# Altium schematic sheet adc.SchDoc: ADC and current shunts
size A3; Author: Daniele Basile <asterix@develer.com>; Organization: Develer s.r.l.; Address1: via Mugellese 1/A; Address2: 50019 Campi Bisenzio; Address3: Firenze; Address4: ITALY; DocumentNumber: 4; Revision: A; SheetNumber: 4; SheetTotal: 4; Hw_rev: R1
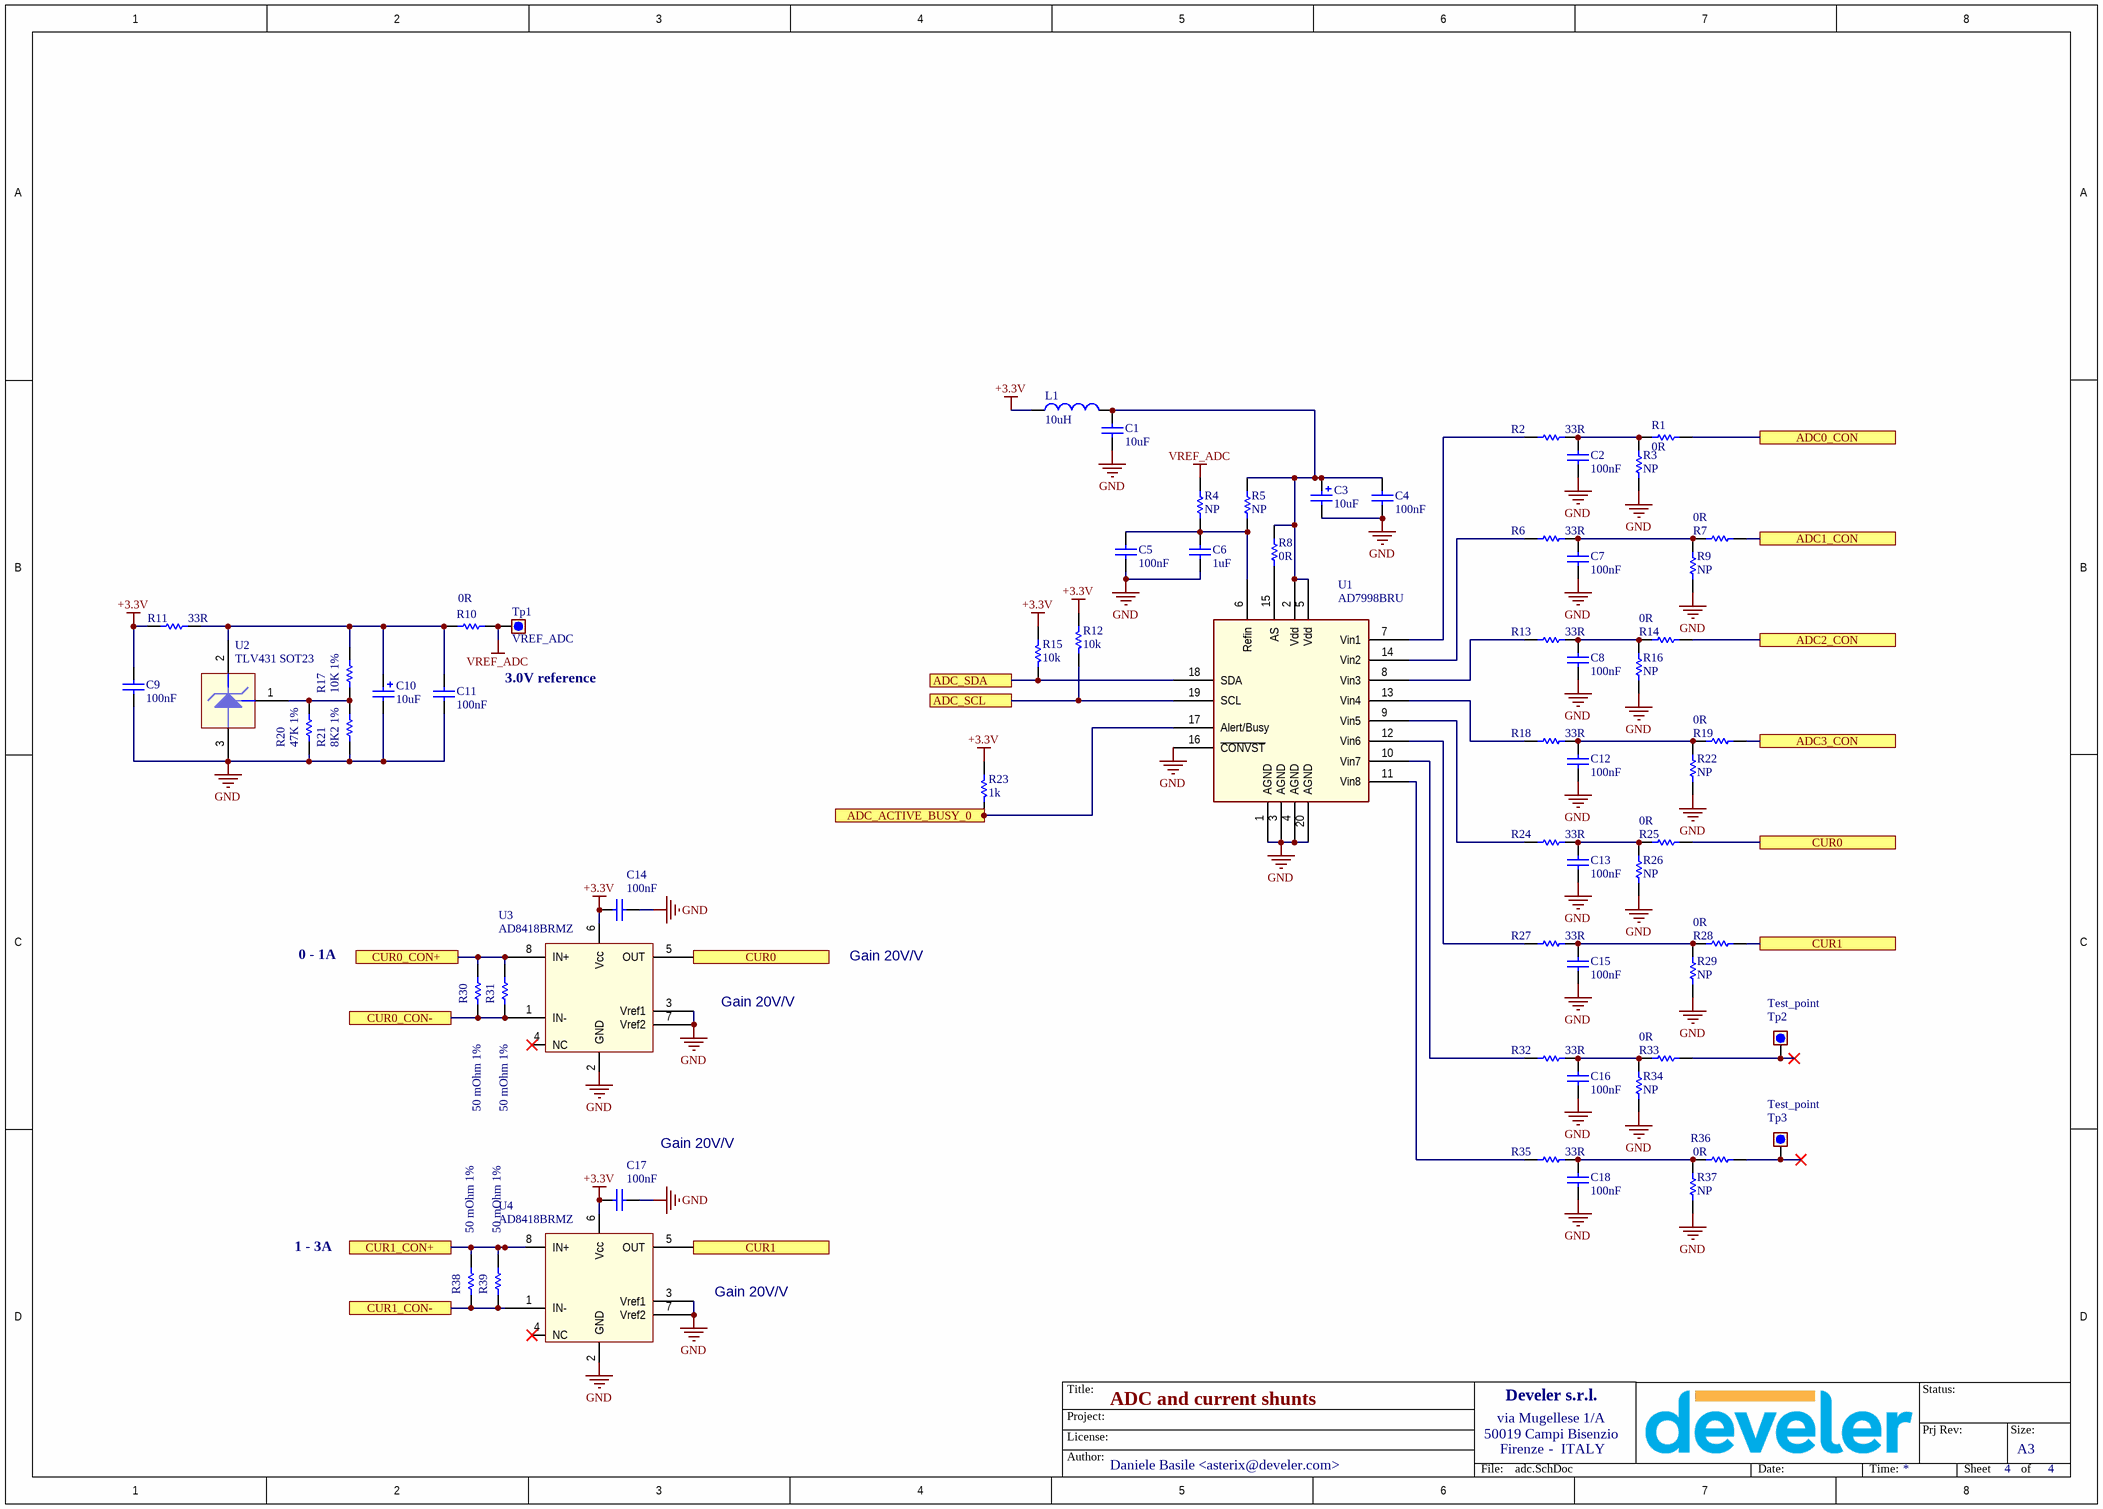
[diagram p0: adc.SchDoc]

## Parts
C1  10uF  [1206_[3216]]
C2  100nF  [0603_[1608]]
C3  10uF  [0805_[2012]]
C4  100nF  [0603_[1608]]
C5  100nF  [0603_[1608]]
C6  1uF  [0603_[1608]]
C7  100nF  [0603_[1608]]
C8  100nF  [0603_[1608]]
C9  100nF  [0603_[1608]]
C10  10uF  [0805_[2012]]
C11  100nF  [0603_[1608]]
C12  100nF  [0603_[1608]]
C13  100nF  [0603_[1608]]
C14  100nF  [0603_[1608]]
C15  100nF  [0603_[1608]]
C16  100nF  [0603_[1608]]
C17  100nF  [0603_[1608]]
C18  100nF  [0603_[1608]]
L1  10uH  [1210_[3225]]
R1  0R  [0603_[1608]]
R2  33R  [0603_[1608]]
R3  NP  [0603_[1608]]
R4  NP  [0603_[1608]]
R5  NP  [0603_[1608]]
R6  33R  [0603_[1608]]
R7  0R  [0603_[1608]]
R8  0R  [0603_[1608]]
R9  NP  [0603_[1608]]
R10  0R  [0603_[1608]]
R11  33R  [0603_[1608]]
R12  10k  [0603_[1608]]
R13  33R  [0603_[1608]]
R14  0R  [0603_[1608]]
R15  10k  [0603_[1608]]
R16  NP  [0603_[1608]]
R17  10K 1%  [0603_[1608]]
R18  33R  [0603_[1608]]
R19  0R  [0603_[1608]]
R20  47K 1%  [0603_[1608]]
R21  8K2 1%  [0603_[1608]]
R22  NP  [0603_[1608]]
R23  1k  [0603_[1608]]
R24  33R  [0603_[1608]]
R25  0R  [0603_[1608]]
R26  NP  [0603_[1608]]
R27  33R  [0603_[1608]]
R28  0R  [0603_[1608]]
R29  NP  [0603_[1608]]
R30  50 mOhm 1%  [1210_[3225]]
R31  50 mOhm 1%  [1210_[3225]]
R32  33R  [0603_[1608]]
R33  0R  [0603_[1608]]
R34  NP  [0603_[1608]]
R35  33R  [0603_[1608]]
R36  0R  [0603_[1608]]
R37  NP  [0603_[1608]]
R38  50 mOhm 1%  [1210_[3225]]
R39  50 mOhm 1%  [1210_[3225]]
Tp1  VREF_ADC  [TEST_POINT_THD_D1.6MM]  (no BOM)
Tp2  Test_point  [TEST_POINT_THD_D1.6MM]  (no BOM)
Tp3  Test_point  [TEST_POINT_THD_D1.6MM]  (no BOM)
U1  AD7998BRU  [TSOP65P640X120-20L]
U2  TLV431 SOT23  [SOT-23]
U3  AD8418BRMZ  [MSOP65P490X110-8P]
U4  AD8418BRMZ  [MSOP65P490X110-8P]

## Ports
ADC0_CON, ADC1_CON, ADC2_CON, ADC3_CON, ADC_ACTIVE_BUSY_0, ADC_SCL, ADC_SDA, CUR0, CUR0_CON+, CUR0_CON-, CUR1, CUR1_CON+, CUR1_CON-

## Nets
+3.3V: C9.2 C14.2 C17.2 L1.1 R11.2 R12.2 R15.2 R23.2 U3.6(Vcc) U4.6(Vcc)
GND: C1.1 C2.1 C3.2 C4.1 C5.1 C6.1 C7.1 C8.1 C9.1 C10.2 C11.1 C12.1 C13.1 C14.1 C15.1 C16.1 C17.1 C18.1 R3.2 R9.2 R16.2 R20.2 R21.1 R22.2 R26.2 R29.2 R34.2 R37.2 U1.1(AGND) U1.3(AGND) U1.4(AGND) U1.16(~{CONVST}) U1.20(AGND) U2.3(A) U3.2(GND) U3.3(Vref1) U3.7(Vref2) U4.2(GND) U4.3(Vref1) U4.7(Vref2)
VREF_ADC: R4.2 R10.2 Tp1.1
ADC0_CON: R1.1 ; port ADC0_CON
ADC1_CON: R7.1 ; port ADC1_CON
ADC2_CON: R14.1 ; port ADC2_CON
ADC3_CON: R19.1 ; port ADC3_CON
ADC_ACTIVE_BUSY_0: R23.1 U1.17(Alert/Busy) ; port ADC_ACTIVE_BUSY_0
ADC_SCL: R12.1 U1.19(SCL) ; port ADC_SCL
ADC_SDA: R15.1 U1.18(SDA) ; port ADC_SDA
CUR0: R25.1 U3.5(OUT) ; port CUR0
CUR0_CON+: R30.2 R31.2 U3.8(IN+) ; port CUR0_CON+
CUR0_CON-: R30.1 R31.1 U3.1(IN-) ; port CUR0_CON-
CUR1: R28.1 U4.5(OUT) ; port CUR1
CUR1_CON+: R38.2 R39.2 U4.8(IN+) ; port CUR1_CON+
CUR1_CON-: R38.1 R39.1 U4.1(IN-) ; port CUR1_CON-
NetC1_2: C1.2 C3.1 C4.2 L1.2 R5.2 R8.2 U1.2(Vdd) U1.5(Vdd)
NetC2_2: C2.2 R1.2 R2.2 R3.1
NetC5_2: C5.2 C6.2 R4.1 R5.1 U1.6(Refin)
NetC7_2: C7.2 R6.2 R7.2 R9.1
NetC8_2: C8.2 R13.2 R14.2 R16.1
NetC10_1: C10.1 C11.2 R10.1 R11.1 R17.1 U2.2(K)
NetC12_2: C12.2 R18.2 R19.2 R22.1
NetC13_2: C13.2 R24.2 R25.2 R26.1
NetC15_2: C15.2 R27.2 R28.2 R29.1
NetC16_2: C16.2 R32.2 R33.2 R34.1
NetC18_2: C18.2 R35.2 R36.2 R37.1
NetR2_1: R2.1 U1.7(Vin1)
NetR6_1: R6.1 U1.14(Vin2)
NetR8_1: R8.1 U1.15(AS)
NetR13_1: R13.1 U1.8(Vin3)
NetR17_2: R17.2 R20.1 R21.2 U2.1(REF)
NetR18_1: R18.1 U1.13(Vin4)
NetR24_1: R24.1 U1.9(Vin5)
NetR27_1: R27.1 U1.12(Vin6)
NetR32_1: R32.1 U1.10(Vin7)
NetR33_1: R33.1 Tp2.1
NetR35_1: R35.1 U1.11(Vin8)
NetR36_1: R36.1 Tp3.1

Not connected (* = marked no-connect by the designer): U3 4(NC)*; U4 4(NC)*

## Notes on the sheet
- 3.0V reference
- 0 - 1A
- Gain 20V/V
- 1 - 3A
- Title:
- Status:
- Author:
- License:
- Project:
- -
- Prj Rev:
- Size:
- A3
- File:
- Date:
- Time:
- Sheet
- of

## Library data of the parts
C1 = Cap: Ceramic X7R 25V; Value: 100pF; Published: 8-Jun-2000; LatestRevisionDate: 17-Jul-2002; LatestRevisionNote: Re-released for DXP Platform.; PackageReference: RAD-0.3; Publisher: Altium Limited; PackageDescription: Radial Cap, Thru-Hole; 2 Leads; 0.3 in Pin Spacing
C2 C4 C5 C7 C8 C11-C18 = Cap: Ceramic X7R 50V; Value: 100pF; Published: 8-Jun-2000; LatestRevisionDate: 17-Jul-2002; LatestRevisionNote: Re-released for DXP Platform.; PackageReference: RAD-0.3; Publisher: Altium Limited; PackageDescription: Radial Cap, Thru-Hole; 2 Leads; 0.3 in Pin Spacing
C3 C10 = Cap Pol1: Ceramic X5R 10V; Published: 8-Jun-2000; Revision: July-2002: Re-released for DXP Platform.; Publisher: Altium Limited
C6 = Cap: Ceramic X5R 25V; Value: 100pF; Published: 8-Jun-2000; LatestRevisionDate: 17-Jul-2002; LatestRevisionNote: Re-released for DXP Platform.; PackageReference: RAD-0.3; Publisher: Altium Limited; PackageDescription: Radial Cap, Thru-Hole; 2 Leads; 0.3 in Pin Spacing
C9 = Cap: Ceramic X7R 50V; Published: 8-Jun-2000; LatestRevisionDate: 17-Jul-2002; LatestRevisionNote: Re-released for DXP Platform.; PackageReference: RAD-0.3; Publisher: Altium Limited; PackageDescription: Radial Cap, Thru-Hole; 2 Leads; 0.3 in Pin Spacing
L1 = Inductor: INDUCTOR, 1210 CASE, 10.0UH (ELJPA100KF); Code_IEC: 1005; Value: 10mH; Published: 8-Jun-2000; LatestRevisionDate: 29-May-2009; LatestRevisionNote: IPC-7351 Footprint Added.; PackageReference: 0402-A; Publisher: Altium Limited; PackageDescription: Chip Inductor; Code_JEITA: 0402
R1 = Res1: Resistor; Value: 1K; Published: 8-Jun-2000; Revision: July-2002: Re-released for DXP Platform.; Publisher: Altium Limited
R2-R39 = Res1: Resistor
  R2 R4-R6 R8 R10 R11 R13 R17 R18 R20 R21 R24 R27 R32 R35: Published: 8-Jun-2000; LatestRevisionDate: 17-Jul-2002; LatestRevisionNote: Re-released for DXP Platform.; PackageReference: AXIAL-0.3; Publisher: Altium Limited; PackageDescription: Axial Device, Thru-Hole; 2 Leads; 0.3 in Pin Spacing
  R3 R7 R9 R12 R14-R16 R19 R22 R23 R25 R26 R28-R31 R33 R34 R36-R39: Revision: July-2002: Re-released for DXP Platform.
Tp1-Tp3 = Test_point: Test point
U1 = AD799x: ADC 12bit I2C
U2 = TLV431 3pin: TLV431BQDBZT
U3 U4 = AD8414: 12bit DAC